# Altium project buck_boost_synchronous.PrjPcb
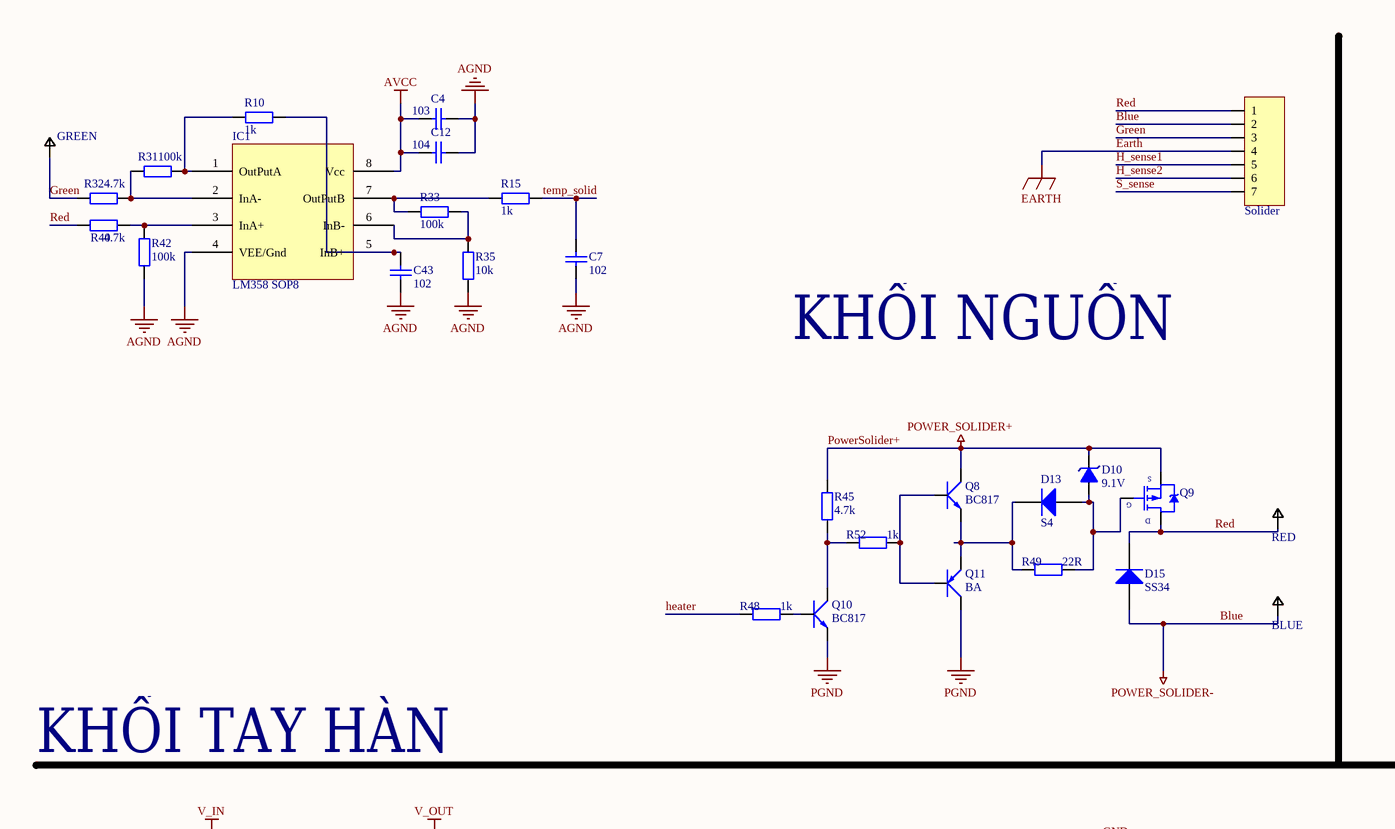
[diagram p0: Sheet2.SchDoc, top left]
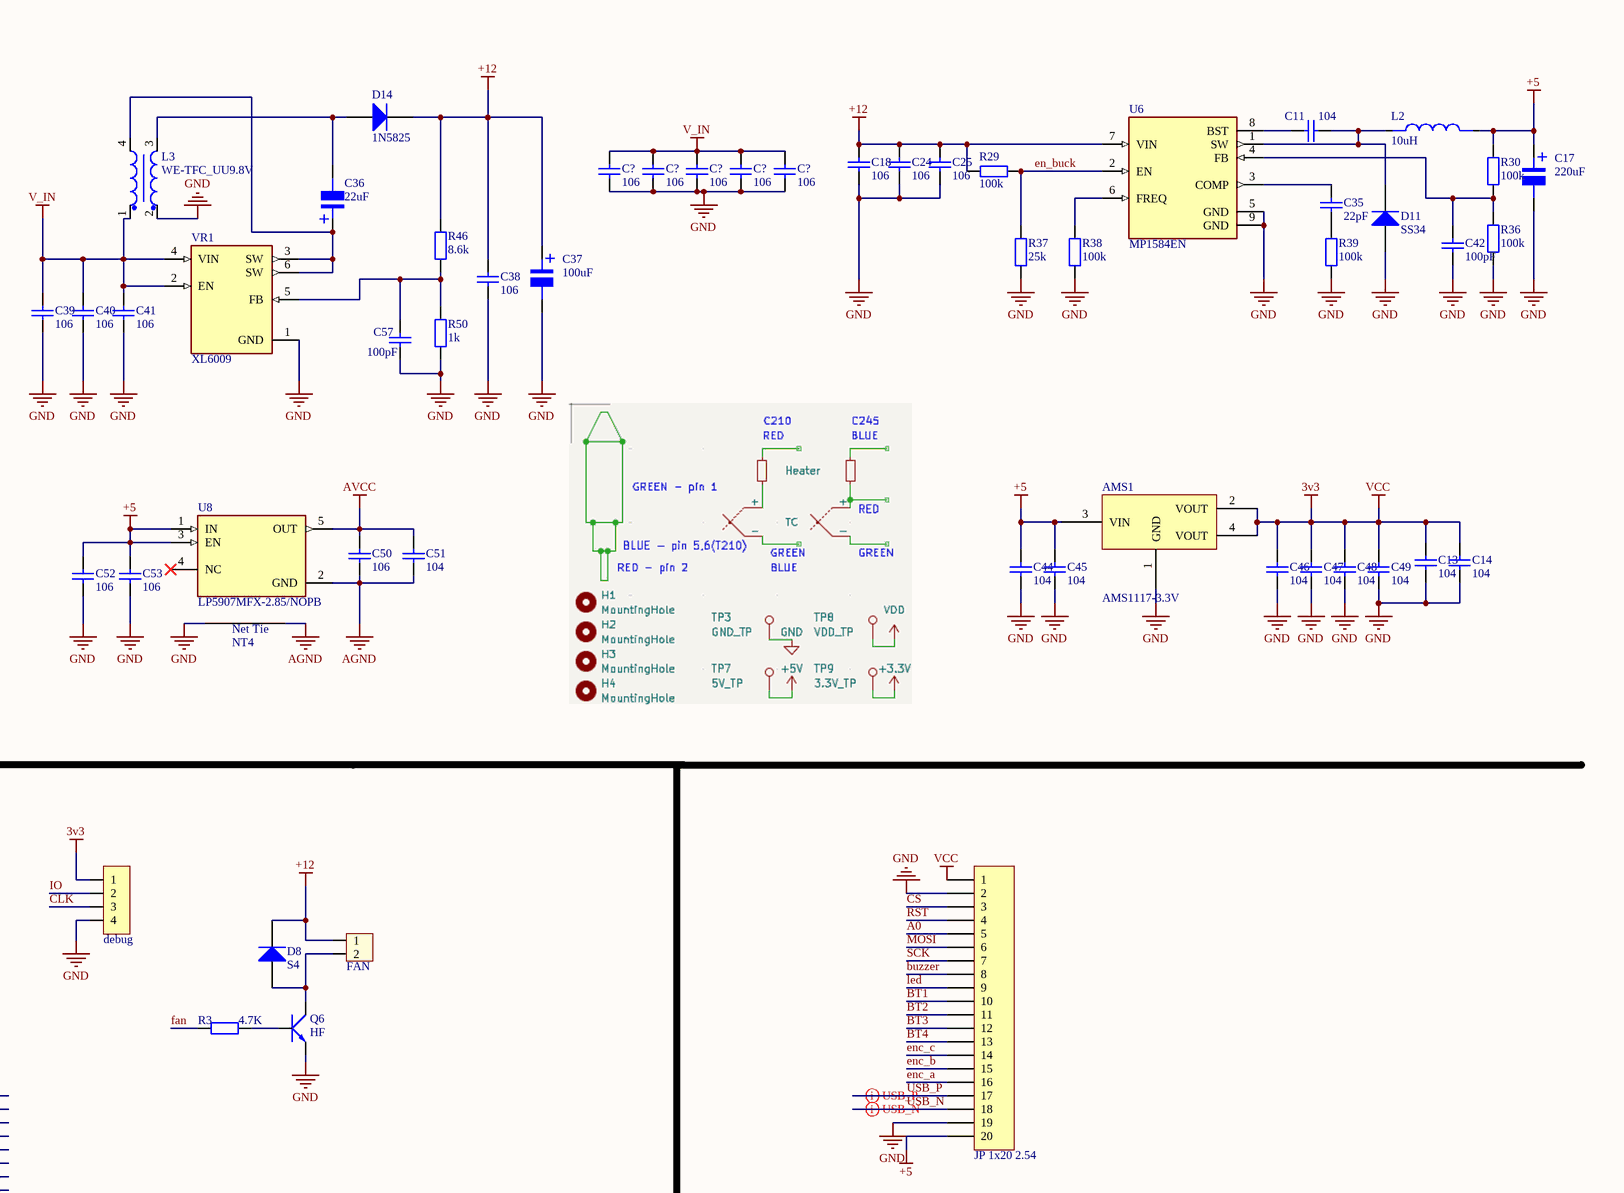
[diagram p1: Sheet2.SchDoc, top right]
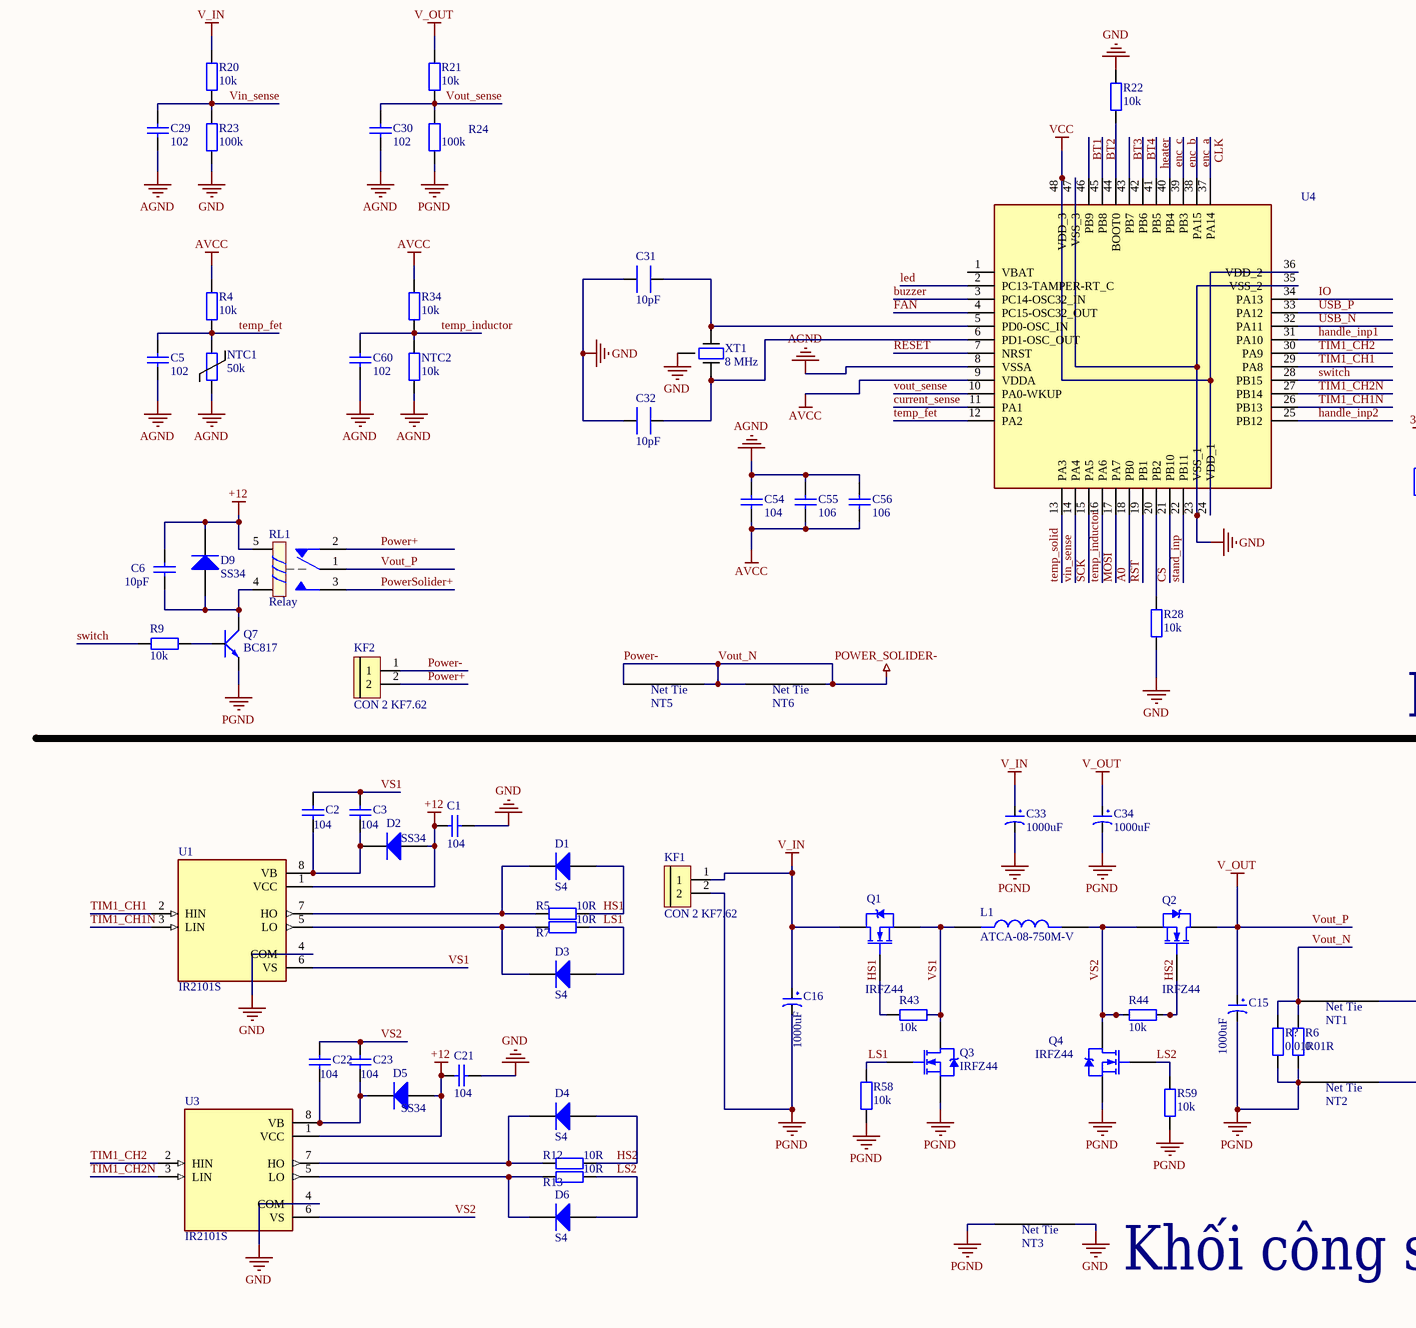
[diagram p2: Sheet2.SchDoc, bottom left]
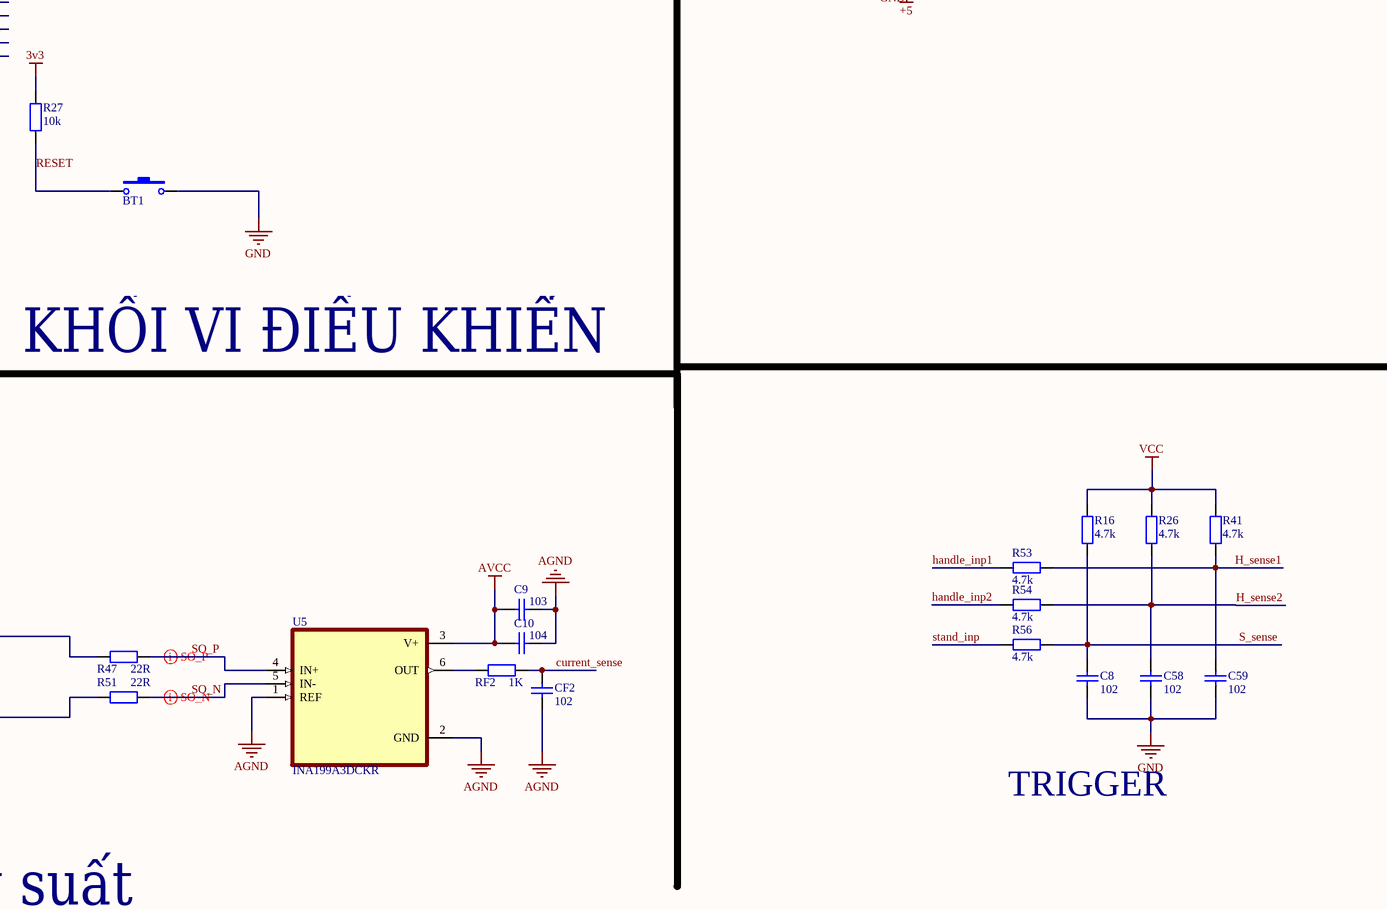
[diagram p3: Sheet2.SchDoc, bottom right]
1 sheet, 166 parts. Net scope: global (net labels, ports and power ports of the same name join across sheets).
Board files: PCB1.PcbDoc, PCB3.PcbDoc

## Sheet Sheet2.SchDoc
size A2; SheetNumber: 1; SheetTotal: 1

### Parts
(Parts that share a designator on the sheet are numbered #1, #2 ... from top to bottom, then left to right.)
AMS1  AMS1117-3.3V  [SOT223]
BLUE  TestPoin  [TP-60]  (value not drawn)
BT1  Nut Nhan 2 Chan SMD 3x6x2.5  [Nut Nhan 2 Chan SMD 3x6x2.5]  (value not drawn)
C1  104  [tu 0603]
C2  104  [tu 0603]
C3  104  [tu 0805]
C4  103  [tu 0603]
C5  102  [tu 0603]
C6  10pF  [tu 0805]
C7  102  [tu 0603]
C8  102  [tu 0603]
C9  103  [tu 0603]
C10  104  [tu 0603]
C11  104  [tu 0603]
C12  104  [tu 0603]
C13  104  [tu 0603]
C14  104  [tu 0603]
C15  1000uF  [tu hoa 10mm]
C16  1000uF  [tu hoa 10mm]
C17  220uF  [tu nhom 6.3 (d)]
C18  106  [tu 0805]
C21  104  [tu 0603]
C22  104  [tu 0603]
C23  104  [tu 0805]
C24  106  [tu 0805]
C25  106  [tu 0805]
C29  102  [tu 0603]
C30  102  [tu 0603]
C31  10pF  [CAPC1608X09L]
C32  10pF  [CAPC1608X09L]
C33  1000uF  [tu hoa 13mm]
C34  1000uF  [tu hoa 13mm]
C35  22pF  [tu 0603]
C36  22uF  [tu nhom 6.3 (D)]
C37  100uF  [tu nhom 10 (g)]
C38  106  [tu 0805]
C39  106  [tu 0805]
C40  106  [tu 0805]
C41  106  [tu 0805]
C42  100pF  [tu 0603]
C43  102  [tu 0603]
C44  104  [tu 0603]
C45  104  [tu 0603]
C46  104  [tu 0603]
C47  104  [tu 0603]
C48  104  [tu 0603]
C49  104  [tu 0603]
C50  106  [tu 0603]
C51  104  [tu 0603]
C52  106  [tu 0603]
C53  106  [tu 0603]
C54  104  [tu 0603]
C55  106  [tu 0603]
C56  106  [tu 0603]
C57  100pF  [tu 0603]
C58  102  [tu 0603]
C59  102  [tu 0603]
C60  102  [tu 0603]
C?#1  106  [tu 0805]
C?#2  106  [tu 0805]
C?#3  106  [tu 0805]
C?#4  106  [tu 0805]
C?#5  106  [tu 0805]
CF2  102  [tu 0603]
D1  S4  [DIODE SOD-123]
D2  SS34  [DIODE SMA]
D3  S4  [DIODE SOD-123]
D4  S4  [DIODE SOD-123]
D5  SS34  [DIODE SMA]
D6  S4  [DIODE SOD-123]
D8  S4  [DIODE SOD-123]
D9  SS34  [DIODE SMA]
D10  9.1V  [DIODE ZENNER SMD SOD80]
D11  SS34  [DIODE SMA]
D13  S4  [DIODE SOD-123]
D14  1N5825  [DIODE SMA]
D15  SS34  [DIODE SMA]
GREEN  TestPoin  [TP-60]  (value not drawn)
H1  FAN  [XH2.54M-2]
IC1  LM358 SOP8  [SOP 8]
JP1  debug  [JP 1x4 DT]
JP2  JP 1x20 2.54  [JP 1x20 DT]
JP5  Solider  [JP 1x7 DT]
KF1  CON 2 KF7.62  [CON 2 KF7.62]
KF2  CON 2 KF7.62  [CON 2 KF7.62]
L1  ATCA-08-750M-V  [IND_ATCA-08-750M-V]
L2  10uH  [CUON CAM SMD 0530]
L3  WE-TFC_UU9.8V  [WE-TFC_UU9.8V]
NT1  0.25mm  [NetTie_0.25mm]  (value not drawn)  (net tie, no BOM)
NT2  0.25mm  [NetTie_0.25mm]  (value not drawn)  (net tie, no BOM)
NT3  NetTie_2mm  [NetTie_2mm]  (value not drawn)  (net tie, no BOM)
NT4  0.25mm  [NetTie_0.25mm]  (value not drawn)  (net tie, no BOM)
NT5  NetTie_2mm  [NetTie_2mm]  (value not drawn)  (net tie, no BOM)
NT6  NetTie_2mm  [NetTie_2mm]  (value not drawn)  (net tie, no BOM)
NTC1  50k  [MF52]
NTC2  10k  [tro smd 0603]
Q1  IRFZ44  [TO220]
Q2  IRFZ44  [TO220]
Q3  IRFZ44  [TO220]
Q4  IRFZ44  [TO220]
Q6  HF  [SOT-23]
Q7  BC817  [SOT-23]
Q8  BC817  [SOT-23]
Q9  IRF4905S  [D2PACK]  (value not drawn)
Q10  BC817  [SOT-23]
Q11  BA  [SOT23]
R3  4.7K  [Tro smd 0603]
R4  10k  [tro smd 0603]
R5  10R  [Tro smd 0603]
R6  0.01R  [tro smd 2512]
R7  10R  [Tro smd 0603]
R9  10k  [Tro smd 0603]
R10  1k  [Tro smd 0603]
R12  10R  [Tro smd 0603]
R13  10R  [Tro smd 0603]
R15  1k  [Tro smd 0603]
R16  4.7k  [Tro smd 0603]
R20  10k  [tro smd 0603]
R21  10k  [tro smd 0603]
R22  10k  [Tro smd 0603]
R23  100k  [tro smd 0603]
R24  100k  [tro smd 0603]
R26  4.7k  [Tro smd 0603]
R27  10k  [Tro smd 0603]
R28  10k  [Tro smd 0603]
R29  100k  [tro smd 0603]
R30  100k  [tro smd 0603]
R31  100k  [Tro smd 0603]
R32  4.7k  [Tro smd 0603]
R33  100k  [Tro smd 0603]
R34  10k  [tro smd 0603]
R35  10k  [Tro smd 0603]
R36  100k  [tro smd 0603]
R37  25k  [tro smd 0603]
R38  100k  [tro smd 0603]
R39  100k  [tro smd 0603]
R40  4.7k  [Tro smd 0603]
R41  4.7k  [Tro smd 0603]
R42  100k  [Tro smd 0603]
R43  10k  [tro smd 0603]
R44  10k  [tro smd 0603]
R45  4.7k  [Tro smd 0603]
R46  8.6k  [tro smd 0603]
R47  22R  [Tro smd 0603]
R48  1k  [Tro smd 0603]
R49  22R  [Tro smd 0603]
R50  1k  [tro smd 0603]
R51  22R  [Tro smd 0603]
R52  1k  [Tro smd 0603]
R53  4.7k  [Tro smd 0603]
R54  4.7k  [Tro smd 0603]
R56  4.7k  [Tro smd 0603]
R58  10k  [tro smd 0603]
R59  10k  [tro smd 0603]
R?  0.01R  [tro smd 2512]
RED  TestPoin  [TP-60]  (value not drawn)
RF2  1K  [Tro smd 0603]
RL1  Relay  [Relay 5 Chan SRD]
U1  IR2101S  [SOIC127P600X175-8N]
U3  IR2101S  [SOIC127P600X175-8N]
U4  STM32F103C8T6  [LQFP-48_19.6_393_58X11_SMD]  (value not drawn)
U5  INA199A3DCKR  [SOT65P210X110-6N]
U6  MP1584EN  [SOIC127P600X170-9N]
U8  LP5907MFX-2.85/NOPB  [SOT95P280X145-5N]
VR1  XL6009  [DPAK170P1435X465-6N]
XT1  8 MHz  [DFN220P320X110-4N]

### Nets
3v3: AMS1.2(VOUT) AMS1.4(VOUT) C13.1 C14.1 C46.1 C47.1 C48.1 C49.1 JP1.1 JP2.1 R16.2 R26.2 R27.2 R41.2 U4.24(VDD_1) U4.36(VDD_2) U4.48(VDD_3)  [also labelled VCC]
+5: AMS1.3(VIN) C17.1 C44.1 C45.1 C52.1 C53.1 JP2.20 L2.2 R30.2 U8.1(IN) U8.3(EN)
+12: C1.1 C6.1 C18.1 C21.1 C24.1 C25.1 C37.1 C38.1 D2.1(A) D5.1(A) D8.2(K) D9.2(K) D14.2(K) H1.1 R29.2 R46.2 RL1.5 U1.1(VCC) U3.1(VCC) U6.7(VIN)
AGND: C4.2 C5.1 C7.1 C9.2 C10.2 C12.2 C29.1 C30.1 C43.1 C50.2 C51.2 C54.2 C55.2 C56.2 C60.1 CF2.1 IC1.4(VEE/Gnd) NT4.2 NTC1.1 NTC2.2 R35.2 R42.2 U4.8(VSSA) U5.1(REF) U5.2(GND) U8.2(GND)
AVCC: C4.1 C9.1 C10.1 C12.1 C50.1 C51.1 C54.1 C55.1 C56.1 IC1.8(Vcc) R4.1 R34.1 U4.9(VDDA) U5.3(V+) U8.5(OUT)
Blue: BLUE.1 D15.1(A) JP5.2 KF2.1 NT1.1 NT5.1 NT5.2 NT6.1 NT6.2 R6.2 R?.2  [also labelled Power-, POWER_SOLIDER-, Vout_N]
Earth: JP5.4
GND: AMS1.1(GND) BT1.2 C1.2 C8.1 C13.2 C14.2 C17.2 C18.2 C21.2 C24.2 C25.2 C31.1 C32.1 C37.2 C38.2 C39.2 C40.2 C41.2 C42.1 C44.2 C45.2 C46.2 C47.2 C48.2 C49.2 C52.2 C53.2 C57.1 C58.1 C59.1 C?#1.2 C?#2.2 C?#3.2 C?#4.2 C?#5.2 D11.1(A) JP1.4 JP2.2 JP2.19 L3.2 NT3.2 NT4.1 Q6.2(E) R22.2 R23.2 R28.1 R36.1 R37.1 R38.1 R39.1 R50.1 U1.4(COM) U3.4(COM) U4.23(VSS_1) U4.35(VSS_2) U4.47(VSS_3) U6.5(GND) U6.9(GND) VR1.1(GND) XT1.G
PGND: C15.2 C16.2 C33.2 C34.2 KF1.2 NT2.1 NT3.1 Q3.3(S) Q4.3(S) Q7.2(E) Q10.2(E) Q11.3(C) R6.1 R24.2 R58.2 R59.2 R?.1
PowerSolider+: D10.2(K) Q8.3(C) Q9.3(S) R45.2 RL1.3  [also labelled POWER_SOLIDER+]
V_IN: C16.1 C33.1 C39.1 C40.1 C41.1 C?#1.1 C?#2.1 C?#3.1 C?#4.1 C?#5.1 KF1.1 L3.1 Q1.2(D) R20.1 VR1.2(EN) VR1.4(VIN)
Vout_P: C15.1 C34.1 Q2.2(D) R21.1 RL1.1  [also labelled V_OUT]
A0: JP2.5 U4.18(PB0)
BT1: JP2.10 U4.46(PB9)
BT2: JP2.11 U4.45(PB8)
BT3: JP2.12 U4.43(PB7)
BT4: JP2.13 U4.42(PB6)
buzzer: JP2.8 U4.3(PC14-OSC32_IN)
CLK: JP1.3 U4.37(PA14)
CS: JP2.3 U4.21(PB10)
current_sense: CF2.2 RF2.2 U4.11(PA1)
en_buck: R29.1 R37.2 U6.2(EN)
enc_a: JP2.16 U4.38(PA15)
enc_b: JP2.15 U4.39(PB3)
enc_c: JP2.14 U4.40(PB4)
FAN: R3.1 U4.4(PC15-OSC32_OUT)
Green: GREEN.1 JP5.3 R32.2
H_sense1: C59.2 JP5.5 R41.1 R53.1
H_sense2: C58.2 JP5.6 R26.1 R54.1
handle_inp1: R53.2 U4.31(PA10)
handle_inp2: R54.2 U4.25(PB12)
heater: R48.1 U4.41(PB5)
HS1: D1.1(A) Q1.1(G) R5.2 R43.1
HS2: D4.1(A) Q2.1(G) R12.2 R44.2
IO: JP1.2 U4.34(PA13)
led: JP2.9 U4.2(PC13-TAMPER-RT_C)
LS1: D3.1(A) Q3.1(G) R7.2 R58.1
LS2: D6.1(A) Q4.1(G) R13.2 R59.1
MOSI: JP2.6 U4.17(PA7)
Power+: KF2.2 RL1.2
Red: D15.2(K) JP5.1 Q9.2(D) R40.2 RED.1
RESET: BT1.1 R27.1 U4.7(NRST)
RST: JP2.4 U4.19(PB1)
S_sense: C8.2 JP5.7 R16.1 R56.1
SCK: JP2.7 U4.15(PA5)
SO_N: R51.2 U5.5(IN-)
SO_P: R47.2 U5.4(IN+)
stand_inp: R56.2 U4.22(PB11)
switch: R9.2 U4.28(PB15)
temp_fet: C5.2 NTC1.2 R4.2 U4.12(PA2)
temp_inductor: C60.2 NTC2.1 R34.2 U4.16(PA6)
temp_solid: C7.2 R15.2 U4.13(PA3)
TIM1_CH1: U1.2(HIN) U4.29(PA8)
TIM1_CH1N: U1.3(LIN) U4.26(PB13)
TIM1_CH2: U3.2(HIN) U4.30(PA9)
TIM1_CH2N: U3.3(LIN) U4.27(PB14)
USB_N: JP2.18 U4.32(PA11)
USB_P: JP2.17 U4.33(PA12)
Vin_sense: C29.2 R20.2 R23.1 U4.14(PA4)
Vout_sense: C30.2 R21.2 R24.1 U4.10(PA0-WKUP)
VS1: C2.2 C3.1 L1.1 Q1.3(S) Q3.2(D) R43.2 U1.6(VS)
VS2: C22.1 C23.1 L1.2 Q2.3(S) Q4.2(D) R44.1 U3.6(VS)
NetC2_1: C2.1 C3.2 D2.2(K) U1.8(VB)
NetC6_2: C6.2 D9.1(A) Q7.3(C) RL1.4
NetC11_1: C11.1 D11.2(K) L2.1 U6.1(SW)
NetC11_2: C11.2 U6.8(BST)
NetC22_2: C22.2 C23.2 D5.2(K) U3.8(VB)
NetC31_2: C31.2 U4.5(PD0-OSC_IN) XT1.1
NetC32_2: C32.2 U4.6(PD1-OSC_OUT) XT1.3
NetC35_1: C35.1 R39.2
NetC35_2: C35.2 U6.3(COMP)
NetC36_1: C36.1 L3.4 VR1.3(SW) VR1.6(SW)
NetC36_2: C36.2 D14.1(A) L3.3
NetC42_2: C42.2 R30.1 R36.2 U6.4(FB)
NetC43_2: C43.2 IC1.5(InB+) R10.1
NetC57_2: C57.2 R46.1 R50.2 VR1.5(FB)
NetD1_2: D1.2(K) R5.1 U1.7(HO)
NetD3_2: D3.2(K) R7.1 U1.5(LO)
NetD4_2: D4.2(K) R12.1 U3.7(HO)
NetD6_2: D6.2(K) R13.1 U3.5(LO)
NetD8_1: D8.1(A) H1.2 Q6.3(C)
NetD10_1: D10.1(A) D13.1(A) Q9.1(G) R49.2
NetD13_2: D13.2(K) Q8.2(E) Q11.2(E) R49.1
NetIC1_1: IC1.1(OutPutA) R10.2 R31.2
NetIC1_2: IC1.2(InA-) R31.1 R32.1
NetIC1_3: IC1.3(InA+) R40.1 R42.1
NetIC1_6: IC1.6(InB-) R33.2 R35.1
NetIC1_7: IC1.7(OutPutB) R15.1 R33.1
NetNT1_2: NT1.2 R47.1
NetNT2_2: NT2.2 R51.1
NetQ6_1: Q6.1(B) R3.2
NetQ7_1: Q7.1(B) R9.1
NetQ8_1: Q8.1(B) Q11.1(B) R52.2
NetQ10_1: Q10.1(B) R48.2
NetQ10_3: Q10.3(C) R45.1 R52.1
NetR22_1: R22.1 U4.44(BOOT0)
NetR28_2: R28.2 U4.20(PB2)
NetR38_2: R38.2 U6.6(FREQ)
NetRF2_1: RF2.1 U5.6(OUT)

Not connected (* = marked no-connect by the designer): U4 1(VBAT); U8 4(NC)*

### Layout directives
differential pair: SO_N, SO_P, USB_N, USB_P

### Notes on the sheet
- KHỐI NGUỒN
- KHỐI TAY HÀN
- KHỐI VI ĐIỀU KHIỂN
- TRIGGER
- Khối công suất
- (in symbol NetTie_0.25mm) Net Tie
- (in symbol NetTie_2mm) Net Tie
- (in symbol Tu Nhom 22uF 25V) +
- (in symbol Tu Nhom 100uF 35V) +
- (in symbol Tu Nhom 220uF 16V) +

### Library data of the parts
AMS1 = AMS1117 SMD: Dán; Value: AMS1117-3.3V SOT223; Don_Vi: Con; Ma_Hang: MH000596; Ghi_Chu: *; Kieu_Chan: *; Chung_Loai: Dán
BT1 = Nut Nhan 2 Chan SMD 3x6x2.5: Ma_Hang: MH001036; Ten: Nút Nhấn 2 Chân 3x6x2.5MM SMD
C1 C2 C13 C14 C21 C22 C44-C49 = Tu 0603 101 50V 10%: Dán; Don_Vi: Con; So_Chan: 2; Ten_Linh_Kien: Tụ 0603 101-0.1nF 10% 50V; Ma_Hang: MH004565; Chung_Loai: Dán; Kieu_Chan: *
C3 C6 C23 = Tu 0805 101 50V 20%: Dán; Don_Vi: Con; So_Chan: 2; Ten_Linh_Kien: Tụ 0805 101-0.1nF 50V 20%; Ma_Hang: MH002806; Chung_Loai: Dán; Kieu_Chan: *
C4 C7-C10 C12 C35 C42 C43 C50-C59 CF2 = Tu 0603 106 16V 20%: Dán; Don_Vi: Con; So_Chan: 2; Ten_Linh_Kien: Tụ 0603-10uF 20% 16V; Ma_Hang: MH004848; Chung_Loai: Dán; Kieu_Chan: *
C5 C11 C29 C30 C60 = Tu 0603 104 50V 10%: Dán; Don_Vi: Con; So_Chan: 2; Ten_Linh_Kien: Tụ 0603 104-100nF 10% 50V; Ma_Hang: MH004568; Chung_Loai: Dán; Kieu_Chan: *
C15 C16 = Tu Hoa 1000uF 10V 10x12: Cắm; So_Chan: 2; Don_Vi: Con; Ten_Linh_Kien: Tụ Hóa 1000uF 10V 10x12MM; Ma_Hang: MH006614; Kieu_Chan: *; Chung_Loai: Cắm
C17 = Tu Nhom 220uF 16V: Dán; Don_Vi: Con; So_Chan: 2; Ten_Linh_Kien: Tụ Nhôm 220uF 16V 6.3x7.7MM; Ma_Hang: MH002227; Chung_Loai: Dán; Kieu_Chan: *
C18 C24 C25 C38-C41 C?#1-C?#5 = Tu 0805 106 16V 10%: Dán; Ten_Linh_Kien: Tụ 0805 106-10uF 10% 16V; So_Chan: 2; Don_Vi: Con; Ma_Hang: MH004553; Chung_Loai: Dán; Kieu_Chan: *
C31 C32 = GRM188R71H104KA93D: CAP CER 0.1UF 50V X7R 0603; Manufacturer: Murata Electronics North America; Tolerance: ±10%; Supplier 1: Digi-Key; Supplier Part Number 1: 490-1519-2-ND; Manufacturer Part Number: GRM188R71H104KA93D; RoHS: RoHS Compliant; Category: Capacitors; Pricing 1: 4000=0.01822, 8000=0.01663, 12000=0.01584 (USD); Packaging: Tape & Reel (TR); Capacitance: 0.1uF; Voltage - Rated: 50V; Temperature Coefficient: X7R; Mounting Type: Surface Mount, MLCC; Operating Temperature: -55°C ~ 125°C; Applications: General Purpose; Ratings: -; Package / Case: 0603 (1608 Metric); Size / Dimension: 0.063" L x 0.032" W (1.60mm x 0.80mm); Height - Seated (Max): -; Thickness (Max): 0.035" (0.90mm); Lead Spacing: -; Features: -; Lead Style: -; ComponentLink1URL: http://www.murata.com/~/media/webrenewal/support/library/catalog/products/capacitor/mlcc/c02e.ashx?la=en-us; ComponentLink1Description: http://www.murata.com/~/media/webrenewal/support/library/catalog/products/capacitor/mlcc/c02e.ashx?la=en-us; Stock: 19812000; Part Status: Active; Supplier 2: Digi-Key; Supplier Part Number 2: 490-1519-1-ND; Pricing 2: 1=0.12, 10=0.084, 100=0.0396, 500=0.02778, 1000=0.023 (USD)
C33 C34 = Tu Hoa 1000uF 50V 13x26: Cắm; Don_Vi: Con; So_Chan: 2; Ten_Linh_Kien: Tụ Hóa 1000uF 50V; Ma_Hang: MH006619; Chung_Loai: Cắm; Kieu_Chan: *
C36 = Tu Nhom 22uF 25V: Dán; Don_Vi: Con; So_Chan: 2; Ten_Linh_Kien: Tụ Nhôm 22uF 25V; Ma_Hang: MH007613; Chung_Loai: Dán; Kieu_Chan: *
C37 = Tu Nhom 100uF 35V: Dán; Don_Vi: Con; Ten_Linh_Kien: Tụ Nhôm 100uF 35V; Ma_Hang: MH004019; So_Chan: 2; Chung_Loai: Dán; Kieu_Chan: *
D1 D3 D4 D6 D8 D13 = Diode S4: Dán; Ten_Linh_Kien: Diode S4 SOD123 ( 1N5819 SOD123); Ma_Hang: MH005519; Don_Vi: Con; Ghi_Chu: *; Chung_Loai: Dán; Kieu_Chan: *
D2 D5 D9 D11 D14 D15 = Diode SS34 ( 1N5822 ): Dán; Don_Vi: Con; Ma_Hang: MH002104; Ten_Linh_Kien: Diode SS34 3A 40V SMA ( 1N5822 SS34A); Kieu_Chan: *; Chung_Loai: Dán
D10 = Diode Zener 9.1V: Dán; Don_Vi: Con; Ma_Hang: MH002882; Ten_Linh_Kien: Diode Zener 1/2W 9.1V SMD1206 ZMM9.1; Ghi_Chu: *; Chung_Loai: Dán; Kieu_Chan: *
H1 = Header 2P 2.54 Duc Thang: Cắm; Ten_Linh_Kien: Header 2P XH2.54-2P Đực Thẳng; Don_Vi: Con; Ma_Hang: MH001283; Chung_Loai: Cắm
IC1 = LM358 SOP8: Dán; Ma_Hang: MH000609; Don_Vi: Con; Ten_Linh_Kien: LM358 SOP8; Kieu_Chan: *; Ghi_Chu: *; Chung_Loai: Dán
JP1 = JP 1x4 2.54 Duc Thang: Cắm; Ten_Linh_Kien: Jump Đơn Đực 2.54MM 1x40P Thẳng 11MM; Don_Vi: Con; Ma_Hang: MH000903; Ghi_Chu: *; Kieu_Chan: *; Chung_Loai: Cắm
JP2 = JP 1x20 2.54 Duc Thang: Cắm; Ten_Linh_Kien: Jump Đơn Đực 2.54MM 1x40P Thẳng 11MM; Don_Vi: Con; Ma_Hang: MH000903; Ghi_Chu: *; Kieu_Chan: *; Chung_Loai: Cắm
JP5 = JP 1x7 2.54 Duc Thang: Cắm; Ten_Linh_Kien: Jump Đơn Đực 2.54MM 1x40P Thẳng 11MM; Don_Vi: Con; Ma_Hang: MH000903; Ghi_Chu: *; Kieu_Chan: *; Chung_Loai: Cắm
KF1 KF2 = CON 2 KF7.62: Cắm; Ma_Hang: MH002053; Ten_Linh_Kien: CON 2 KF7.62-2P 7.62MM (Đen Thẳng); Chung_Loai: Cắm; Ghi_Chu: *; Kieu_Chan: *; Don_Vi: Con
L2 = Cuon Cam SMD 0530: SMD 0530; MP: FDV0530-H-1R5M=P3; Package: None; Price: None; Value: *; Availability: Unavailable
L3 = WE-TFC_UU9.8V: Size Typ UU; L = 25 mH; IR = 0.25 A; RDC = 3.6 â„¦; MF: Wurth Electronics; MP: 744862250; SnapEDA_Link: https://www.snapeda.com/parts/744862250/Wurth+Electronics/view-part/?ref=snap; Package: Vertical-4 Wurth Electronics; Value: *; Check_prices: https://www.snapeda.com/parts/744862250/Wurth+Electronics/view-part/?ref=eda
NT1 NT2 NT4 = NetTie_0.25mm
NTC1 = NCP15XH103F03RC: THERMISTOR 10K OHM NTC 0402 SMD
NTC2 R4 R20 R21 R23 R24 R34 = Tro 0603 5% 10k: Dán; Don_Vi: Con; So_Chan: 2; Ten_Linh_Kien: Trở 0603 5% 10k; Ma_Hang: MH006316; Chung_Loai: Dán; Kieu_Chan: *
Q1-Q4 = FET IRFZ44 DIP: TO-220
Q6 = Trans C1815 HF SMD: SOT-23; Value: C9014
Q7 Q8 Q10 = Trans BC817: SOT-23 - C8658; Value: C9014
Q9 = IRF4905S: 55V 75A
Q11 = Trans A1015 BA SMD: PNP 600mW, ECB
R3 R5 R7 R9 R10 R12 R13 R15 R16 R22 R26-R28 R31-R33 R35 R40-R42 R45 R47-R49 R51-R54 R56 RF2 = Tro 0603 5% 10R: Dán; So_Chan: 2; Ten_Linh_Kien: Trở 0603 5% 10R; Ma_Hang: MH006317; Don_Vi: Con; Chung_Loai: Dán; Kieu_Chan: *
R6 R? = Tro 2512 1% 0.01R: Dán; Don_Vi: Con; So_Chan: 2; Ten_Linh_Kien: Trở 2512 1% R010-0.01R 1W; Ma_Hang: MH004912; Chung_Loai: Dán; Kieu_Chan: *
R29 R30 R36-R39 R43 R44 R46 R50 R58 R59 = Tro 0603 1% 0R: Dán; Don_Vi: Con; So_Chan: 2; Ten_Linh_Kien: Trở 0603 1% 0R; Ma_Hang: MH005792; Chung_Loai: Dán; Kieu_Chan: *
RL1 = Relay 5 Chan SRD: Relay 5 Chan; Ma_Hang: MH009374; Ten: Relay 5V10A SRD-05VDC-SL-C Chính Hãng
U1 U3 = IR2101S: Half-Bridge Gate Driver IC Non-Inverting 8-SOIC; MF: Infineon Technologies; SnapEDA_Link: https://www.snapeda.com/parts/IR2101S/Infineon/view-part/?ref=snap; Package: SOIC-8 Infineon; Value: *; MP: IR2101S; Check_prices: https://www.snapeda.com/parts/IR2101S/Infineon/view-part/?ref=eda
U4 = IC_STM32F103C8T6: ARM® Cortex®-M3 STM32F1 Microcontroller IC 32-Bit 72MHz 64KB (64K x 8) FLASH 48-LQFP (7x7); Manufacturer: STMicroelectronics; Alternate Part Number-1: NA; Manufacturer Part Number: STM32F103C8T6; Case/Package: LQFP48; Supplier-1: LCSC; Supplier Part Number-1: STM32F103C8T6
U5 = INA199A3DCKR: 26V, bi-directional current sense amplifier; MF: Texas Instruments; SnapEDA_Link: https://www.snapeda.com/parts/INA199A3DCKR/Texas+Instruments/view-part/?ref=snap; Package: SOT-SC70-6 Texas Instruments; Value: *; MP: INA199A3DCKR; Check_prices: https://www.snapeda.com/parts/INA199A3DCKR/Texas+Instruments/view-part/?ref=eda
U6 = MP1584EN: Buck Switching Regulator IC Positive Adjustable 0.8V 1 Output 3A 8-SOIC (0.154, 3.90mm Width) Exposed Pad; MF: Monolithic Power; SnapEDA_Link: https://www.snapeda.com/parts/MP1584EN/Monolithic+Power+Systems/view-part/?ref=snap; Package: SOIC-8 Monolithic Power; Value: *; MP: MP1584EN; Check_prices: https://www.snapeda.com/parts/MP1584EN/Monolithic+Power+Systems/view-part/?ref=eda
U8 = LP5907MFX-2.85/NOPB: 250-mA, low-noise, high-PSRR, ultra-low-dropout voltage regulator with low IQ and enable; MF: Texas Instruments; SnapEDA_Link: https://www.snapeda.com/parts/LP5907MFX-2.85/NOPB/Texas+Instruments/view-part/?ref=snap; Package: SOT-23-5 Texas Instruments; Value: *; MP: LP5907MFX-2.85/NOPB; Check_prices: https://www.snapeda.com/parts/LP5907MFX-2.85/NOPB/Texas+Instruments/view-part/?ref=eda
VR1 = XL6009: The XL6009 regulator is a wide input range, current mode, DC/DC converter which is capable of generating either positive or negative output voltages.; MF: XLSEMI; Package: TO-263-5L XLSEMI; Price: None; Value: *; SnapEDA_Link: https://www.snapeda.com/parts/XL6009/XLSEMI/view-part/?ref=snap; MP: XL6009; Availability: Not in stock; Check_prices: https://www.snapeda.com/parts/XL6009/XLSEMI/view-part/?ref=eda
XT1 = ABM3B-8.000MHZ-10-1-U-T: Crystal 8MHz ±10ppm 10pF 200 Ohm -10°C ~ 60°C Surface Mount 4-SMD, No Lead (DFN, LCC); Manufacturer: Abracon LLC; Operating Mode: Fundamental; Value: 8 MHz; Supplier 1: Digi-Key; Supplier Part Number 1: 535-9721-1-ND; RoHS: RoHS Compliant; Category: Crystals, Oscillators, Resonators; Stock: 35437; Pricing 1: 1=0.69, 10=0.578, 50=0.5198, 100=0.462, 500=0.4389 (USD); Packaging: Cut Tape (CT); Part Status: Active; Type: MHz Crystal; Frequency Stability: ±10ppm; Frequency Tolerance: ±10ppm; Load Capacitance: 10pF; Operating Temperature: -10°C ~ 60°C; Ratings: -; Mounting Type: Surface Mount; Package / Case: 4-SMD, No Lead; Size / Dimension: 0.197" L x 0.126" W (5.00mm x 3.20mm); Height - Seated (Max): 0.043" (1.10mm); ComponentLink1URL: http://www.abracon.com/Resonators/abm3b.pdf; ComponentLink1Description: http://www.abracon.com/Resonators/abm3b.pdf; Supplier 2: Digi-Key; Supplier Part Number 2: 535-9721-2-ND; Pricing 2: 1000=0.336, 3000=0.315, 5000=0.3045, 10000=0.294 (USD); Manufacturer Part Number: ABM3B-8.000MHZ-10-1-U-T
L1 = ATCA-08-750M-V: Value: *; MP: ATCA-08-750M-V; Package: None; Availability: Unavailable; Price: None